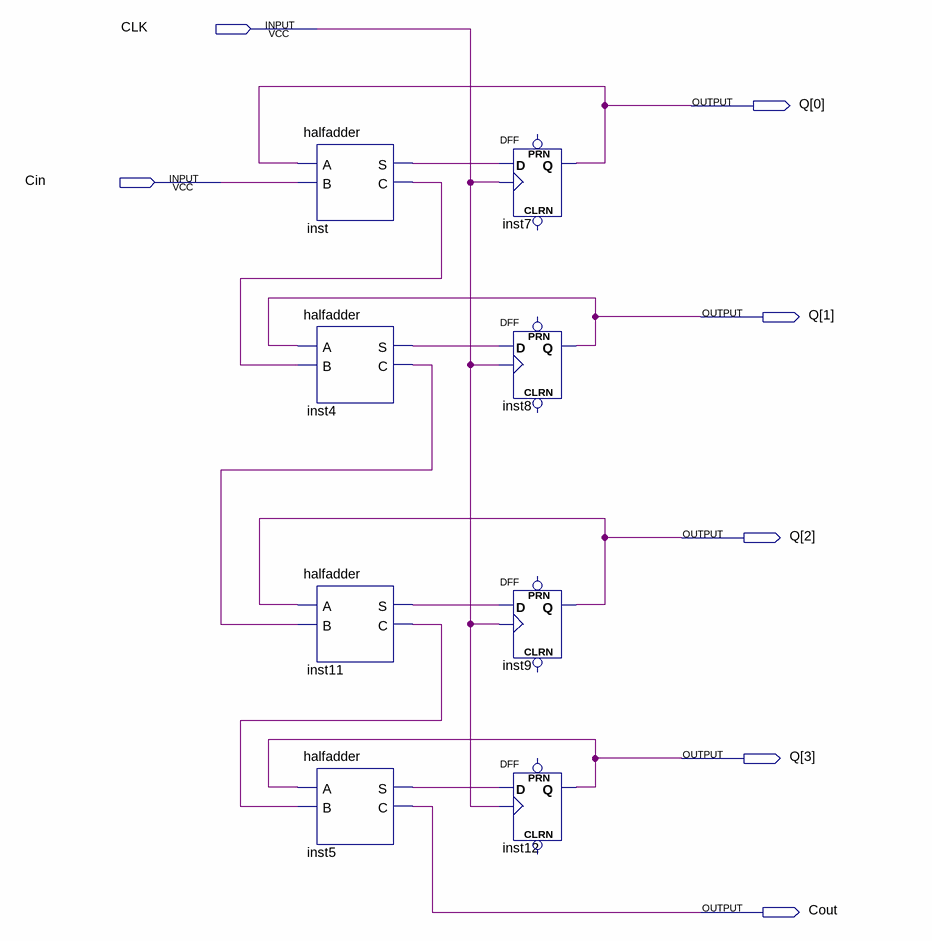
[diagram p0: schematic sheet]
// Quartus schematic fourbitcounter.bdf as structural Verilog: 8 symbols, 7 pins
module fourbitcounter (
  input  CLK,
  input  Cin,
  output [3:0] Q,
  output Cout
);

  wire inst4_c, inst4_s, inst5_s, inst11_c, inst11_s, inst_c, inst_s;

  halfadder inst (.A(Q[0]), .B(Cin), .S(inst_s), .C(inst_c));
  halfadder inst4 (.A(Q[1]), .B(inst_c), .S(inst4_s), .C(inst4_c));
  halfadder inst11 (.A(Q[2]), .B(inst4_c), .S(inst11_s), .C(inst11_c));
  halfadder inst5 (.A(Q[3]), .B(inst11_c), .S(inst5_s), .C(Cout));
  DFF inst7 (.CLK(CLK), .D(inst_s), .Q(Q[0]));  // open: CLRN, PRN
  DFF inst8 (.CLK(CLK), .D(inst4_s), .Q(Q[1]));  // open: CLRN, PRN
  DFF inst9 (.CLK(CLK), .D(inst11_s), .Q(Q[2]));  // open: CLRN, PRN
  DFF inst12 (.CLK(CLK), .D(inst5_s), .Q(Q[3]));  // open: CLRN, PRN
endmodule
